# Altium schematic sheet Power.SchDoc
size A; SheetNumber: 5; SheetTotal: 5
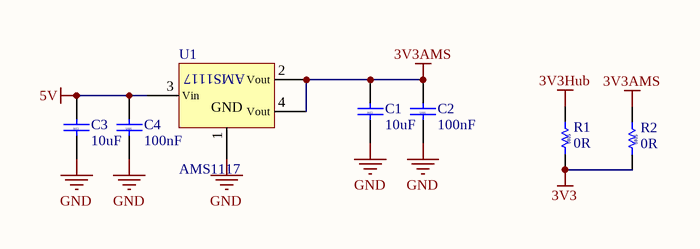
[diagram p0: Power.SchDoc]

## Parts
C1  10uF  [Res 1206]
C2  100nF  [RES 0805]
C3  10uF  [Res 1206]
C4  100nF  [RES 0805]
R1  0R  [RES 0805]
R2  0R  [RES 0805]
U1  AMS1117  [SOT-223]

## Nets
3V3: R1.2 R2.2
3V3AMS: C1.2 C2.2 R2.1 U1.2(Vout) U1.4(Vout)
3V3Hub: R1.1
5V: C3.2 C4.2 U1.3(Vin)
GND: C1.1 C2.1 C3.1 C4.1 U1.1(GND)

## Notes on the sheet
- (in symbol CAP 0805) 0805
- (in symbol CAP 1206) 1206
- (in symbol RES 0805) 0805

## Library data of the parts
C1 C3 = CAP 1206
C2 C4 = CAP 0805
R1 R2 = RES 0805
U1 = AMS1117: Regulators